# Altium project inversor_rev2.PrjPcb
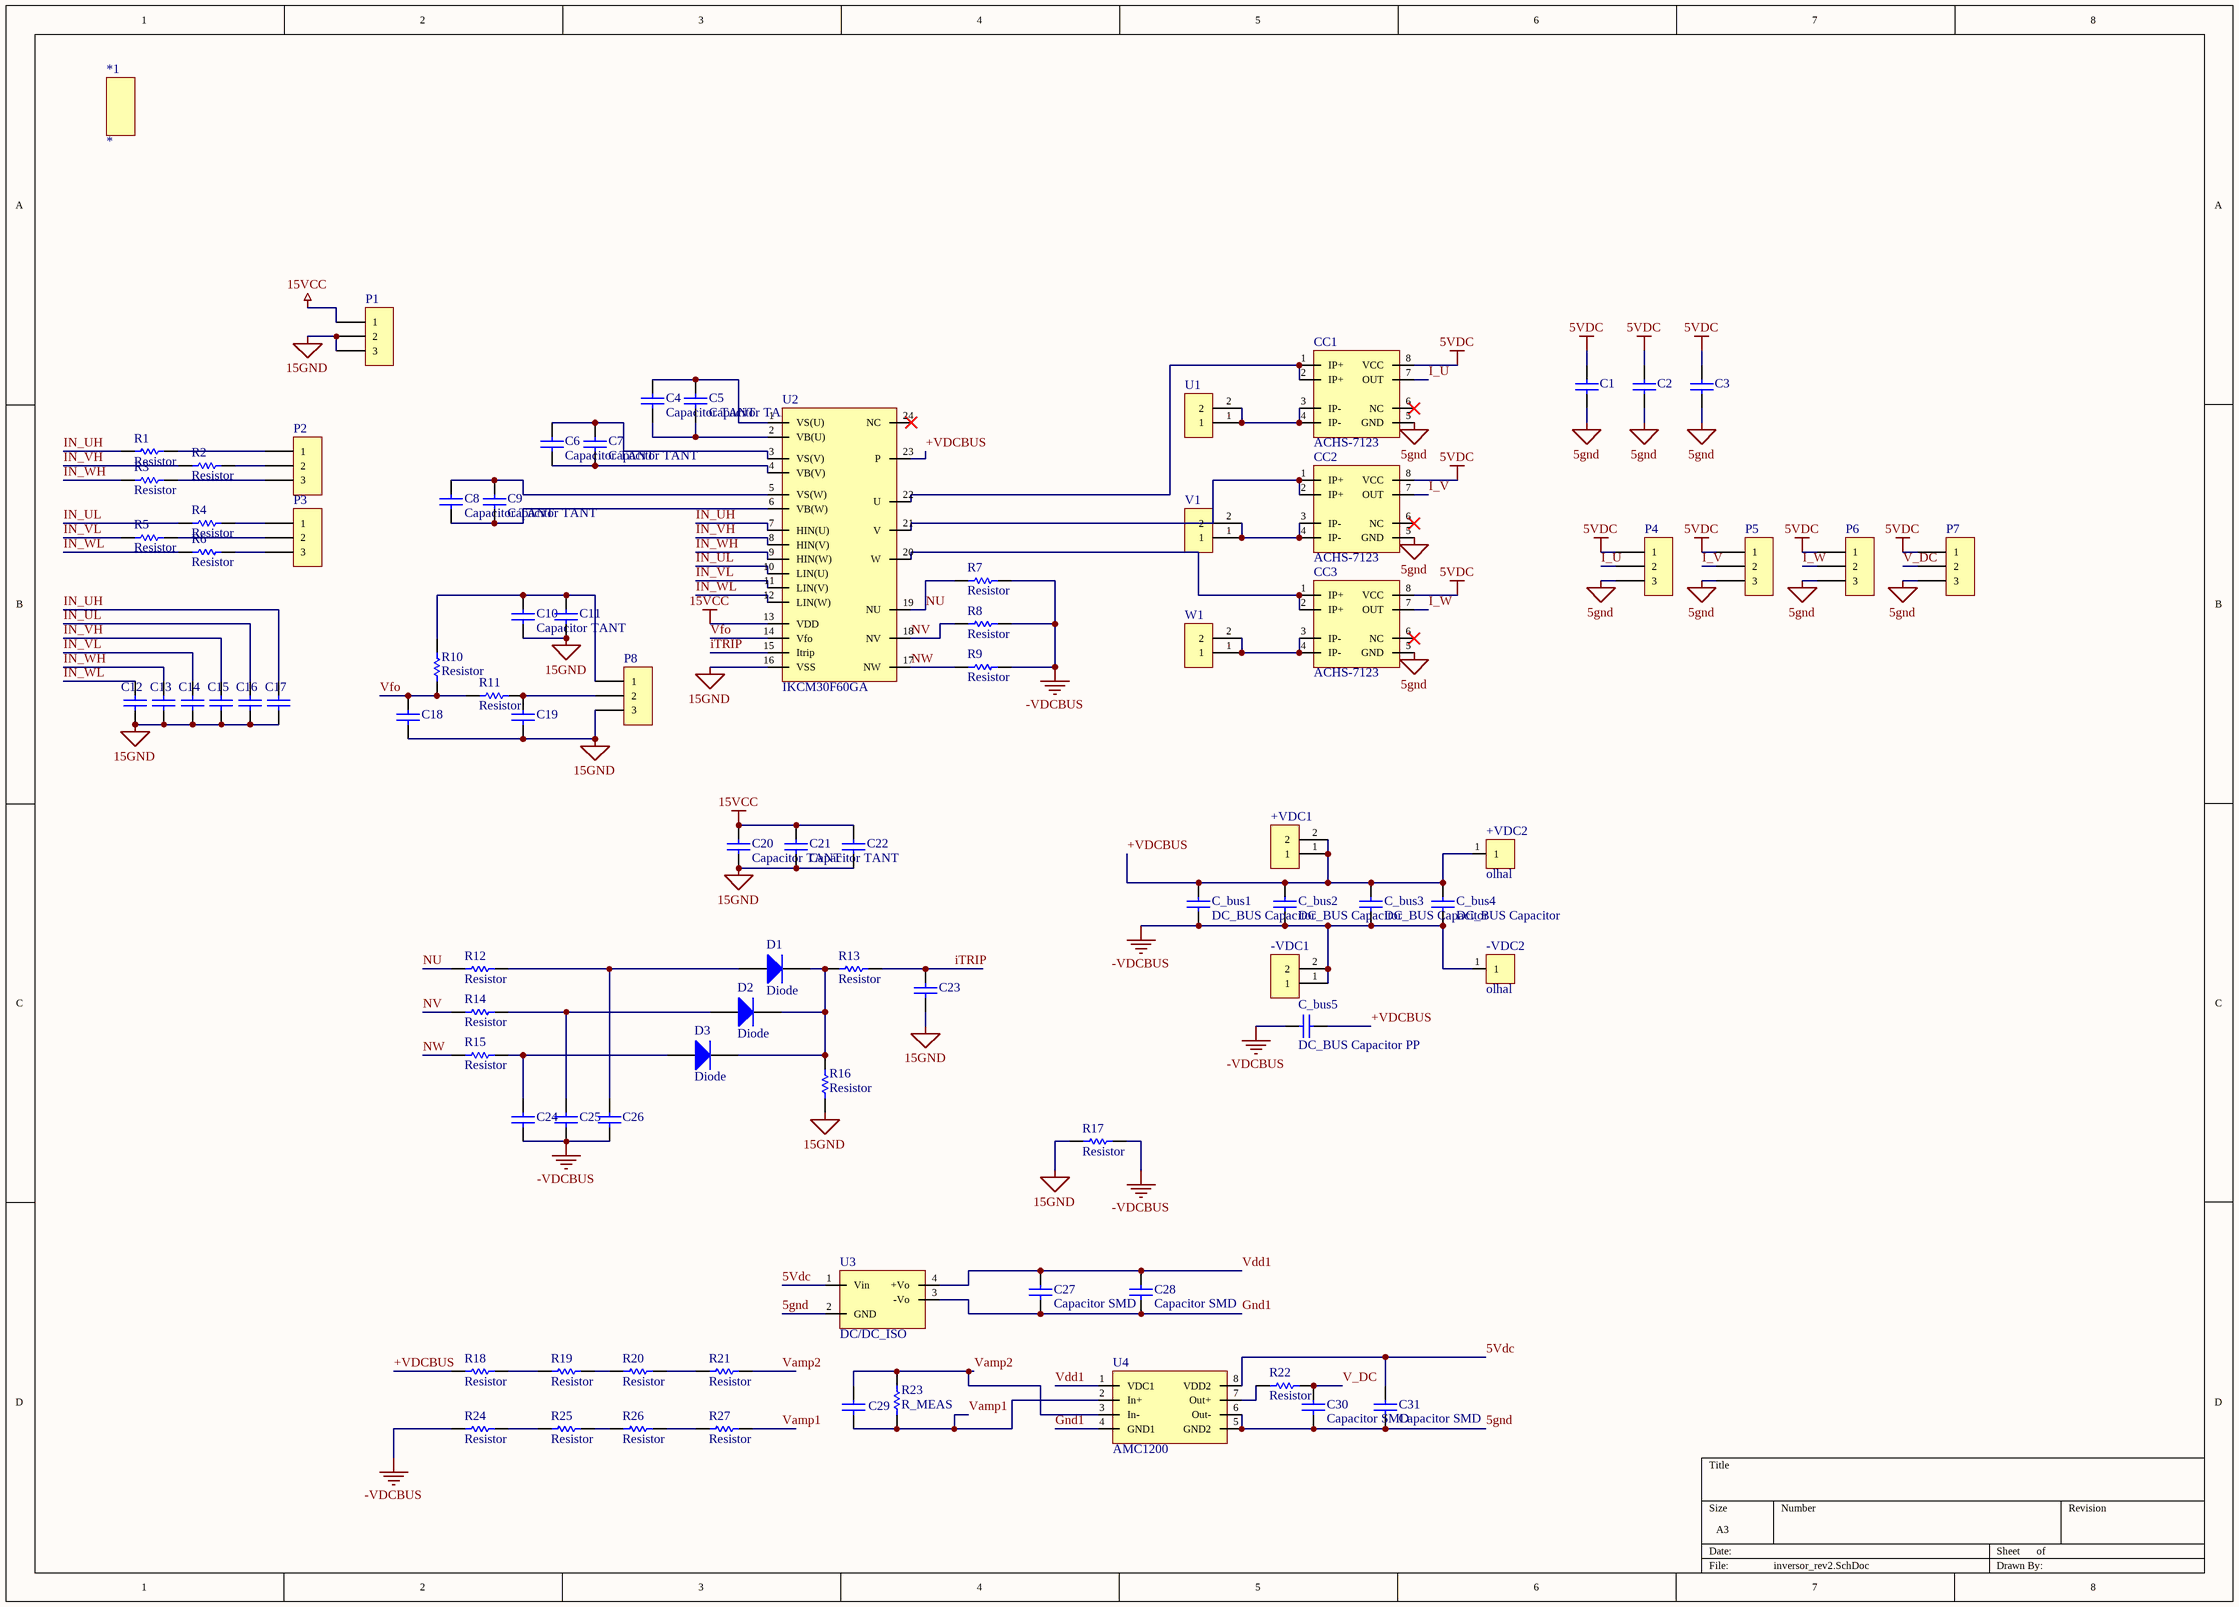
[diagram p0: inversor_rev2.SchDoc]
1 sheet, 88 parts. Net scope: global (net labels, ports and power ports of the same name join across sheets).
Board file: inversor_rev2.PcbDoc

## Sheet inversor_rev2.SchDoc
size A3

### Parts
*1  *  [COOLER]
+VDC1  gen_purpose_conn_1x2  [connector1x2_parafuso]  (value not drawn)
+VDC2  olhal  [Olhal]
-VDC1  gen_purpose_conn_1x2  [connector1x2_parafuso]  (value not drawn)
-VDC2  olhal  [Olhal]
C1  Capacitor SMD  [CAPC_1206]  (value not drawn)
C2  Capacitor SMD  [CAPC_1206]  (value not drawn)
C3  Capacitor SMD  [CAPC_1206]  (value not drawn)
C4  Capacitor TANT  [CAPC_2917]
C5  Capacitor TANT  [CAPC_2917]
C6  Capacitor TANT  [CAPC_2917]
C7  Capacitor TANT  [CAPC_2917]
C8  Capacitor TANT  [CAPC_2917]
C9  Capacitor TANT  [CAPC_2917]
C10  Capacitor TANT  [CAPC_2917]
C11  Capacitor SMD  [CAPC_1206]  (value not drawn)
C12  Capacitor SMD  [CAPC_0805]  (value not drawn)
C13  Capacitor SMD  [CAPC_0805]  (value not drawn)
C14  Capacitor SMD  [CAPC_0805]  (value not drawn)
C15  Capacitor SMD  [CAPC_0805]  (value not drawn)
C16  Capacitor SMD  [CAPC_0805]  (value not drawn)
C17  Capacitor SMD  [CAPC_0805]  (value not drawn)
C18  Capacitor SMD  [CAPC_0805]  (value not drawn)
C19  Capacitor SMD  [CAPC_0805]  (value not drawn)
C20  Capacitor TANT  [CAPC_2917]
C21  Capacitor TANT  [CAPC_2917]
C22  Capacitor SMD  [CAPC_1206]  (value not drawn)
C23  Capacitor SMD  [CAPC_0805]  (value not drawn)
C24  Capacitor SMD  [CAPC_0805]  (value not drawn)
C25  Capacitor SMD  [CAPC_0805]  (value not drawn)
C26  Capacitor SMD  [CAPC_0805]  (value not drawn)
C27  Capacitor SMD  [CAPC_0805]
C28  Capacitor SMD  [CAPC_0805]
C29  Capacitor SMD  [CAPC_0805]  (value not drawn)
C30  Capacitor SMD  [CAPC_0805]
C31  Capacitor SMD  [CAPC_0805]
C_bus1  DC_BUS Capacitor  [Capacitor_DCBUS]
C_bus2  DC_BUS Capacitor  [Capacitor_DCBUS]
C_bus3  DC_BUS Capacitor  [Capacitor_DCBUS]
C_bus4  DC_BUS Capacitor  [Capacitor_DCBUS]
C_bus5  DC_BUS Capacitor PP  [Snubber_cap_0.47uF]
CC1  ACHS-7123  [CC6303_SOP8]
CC2  ACHS-7123  [CC6303_SOP8]
CC3  ACHS-7123  [CC6303_SOP8]
D1  Diode  [Diode_th]
D2  Diode  [Diode_th]
D3  Diode  [Diode_th]
P1  Header 3  [HDR1X3]  (value not drawn)
P2  Header 3  [HDR1X3]  (value not drawn)
P3  Header 3  [HDR1X3]  (value not drawn)
P4  Header 3  [HDR1X3]  (value not drawn)
P5  Header 3  [HDR1X3]  (value not drawn)
P6  Header 3  [HDR1X3]  (value not drawn)
P7  Header 3  [HDR1X3]  (value not drawn)
P8  Header 3  [HDR1X3]  (value not drawn)
R1  Resistor  [RESC_0805]
R2  Resistor  [RESC_0805]
R3  Resistor  [RESC_0805]
R4  Resistor  [RESC_0805]
R5  Resistor  [RESC_0805]
R6  Resistor  [RESC_0805]
R7  Resistor  [RESC6432X09M]
R8  Resistor  [RESC6432X09M]
R9  Resistor  [RESC6432X09M]
R10  Resistor  [RESC_0805]
R11  Resistor  [RESC_0805]
R12  Resistor  [RESC_0805]
R13  Resistor  [RESC_0805]
R14  Resistor  [RESC_0805]
R15  Resistor  [RESC_0805]
R16  Resistor  [RESC_0805]
R17  Resistor  [RESC_0805]
R18  Resistor  [RESC_0805]
R19  Resistor  [RESC_0805]
R20  Resistor  [RESC_0805]
R21  Resistor  [RESC_0805]
R22  Resistor  [RESC_0805]
R23  R_MEAS  [RESC_0805]
R24  Resistor  [RESC_0805]
R25  Resistor  [RESC_0805]
R26  Resistor  [RESC_0805]
R27  Resistor  [RESC_0805]
U1  gen_purpose_conn_1x2  [connector1x2_parafuso]  (value not drawn)
U2  IKCM30F60GA  [ikcm30f60ga]
U3  DC/DC_ISO  [DC/DC_ISO]
U4  AMC1200  [SOIC8]
V1  gen_purpose_conn_1x2  [connector1x2_parafuso]  (value not drawn)
W1  gen_purpose_conn_1x2  [connector1x2_parafuso]  (value not drawn)

### Nets
5gnd: C1.1 C2.1 C3.1 C30.1 C31.1 CC1.5(GND) CC2.5(GND) CC3.5(GND) P4.3 P5.3 P6.3 P7.3 U3.2(GND) U4.5(GND2) U4.6(Out-)
5Vdc: C1.2 C2.2 C3.2 C31.2 CC1.8(VCC) CC2.8(VCC) CC3.8(VCC) P4.1 P5.1 P6.1 P7.1 U3.1(Vin) U4.8(VDD2)
15GND: C10.1 C11.1 C12.1 C13.1 C14.1 C15.1 C16.1 C17.1 C18.1 C19.1 C20.1 C21.1 C22.1 C23.1 P1.2 P1.3 P8.3 R16.1 R17.1 U2.16(VSS)
15VCC: C20.2 C21.2 C22.2 P1.1 U2.13(VDD)
-VDCBUS: -VDC1.1 -VDC1.2 -VDC2.1 C24.1 C25.1 C26.1 C_bus1.1 C_bus2.1 C_bus3.1 C_bus4.1 C_bus5.1 R7.2 R8.2 R9.2 R17.2 R24.1
+VDCBUS: +VDC1.1 +VDC1.2 +VDC2.1 C_bus1.2 C_bus2.2 C_bus3.2 C_bus4.2 C_bus5.2 R18.1 U2.23(P)
Gnd1: C27.1 C28.1 U3.3(-Vo) U4.4(GND1)
I_U: CC1.7(OUT) P4.2
I_V: CC2.7(OUT) P5.2
I_W: CC3.7(OUT) P6.2
IN_UH: C17.2 R1.1 U2.7(HIN(U))
IN_UL: C16.2 R4.1 U2.10(LIN(U))
IN_VH: C15.2 R2.1 U2.8(HIN(V))
IN_VL: C14.2 R5.1 U2.11(LIN(V))
IN_WH: C13.2 R3.1 U2.9(HIN(W))
IN_WL: C12.2 R6.1 U2.12(LIN(W))
iTRIP: C23.2 R13.2 U2.15(Itrip)
NU: R7.1 R12.1 U2.19(NU)
NV: R8.1 R14.1 U2.18(NV)
NW: R9.1 R15.1 U2.17(NW)
V_DC: C30.2 P7.2 R22.2
Vamp1: C29.1 R23.1 R27.2 U4.2(In+)
Vamp2: C29.2 R21.2 R23.2 U4.3(In-)
Vdd1: C27.2 C28.2 U3.4(+Vo) U4.1(VDC1)
Vfo: C18.2 R10.2 R11.1 U2.14(Vfo)
NetC4_1: C4.1 C5.1 U2.2(VB(U))
NetC4_2: C4.2 C5.2 U2.1(VS(U))
NetC6_1: C6.1 C7.1 U2.4(VB(V))
NetC6_2: C6.2 C7.2 U2.3(VS(V))
NetC8_1: C8.1 C9.1 U2.6(VB(W))
NetC8_2: C8.2 C9.2 U2.5(VS(W))
NetC10_2: C10.2 C11.2 P8.1 R10.1
NetC19_2: C19.2 P8.2 R11.2
NetC24_2: C24.2 D3.1(A) R15.2
NetC25_2: C25.2 D2.1(A) R14.2
NetC26_2: C26.2 D1.1(A) R12.2
NetCC1_1: CC1.1(IP+) CC1.2(IP+) U2.22(U)
NetCC1_3: CC1.3(IP-) CC1.4(IP-) U1.1 U1.2
NetCC2_1: CC2.1(IP+) CC2.2(IP+) U2.21(V)
NetCC2_3: CC2.3(IP-) CC2.4(IP-) V1.1 V1.2
NetCC3_1: CC3.1(IP+) CC3.2(IP+) U2.20(W)
NetCC3_3: CC3.3(IP-) CC3.4(IP-) W1.1 W1.2
NetD1_2: D1.2(K) D2.2(K) D3.2(K) R13.1 R16.2
NetP2_1: P2.1 R1.2
NetP2_2: P2.2 R2.2
NetP2_3: P2.3 R3.2
NetP3_1: P3.1 R4.2
NetP3_2: P3.2 R5.2
NetP3_3: P3.3 R6.2
NetR18_2: R18.2 R19.1
NetR19_2: R19.2 R20.1
NetR20_2: R20.2 R21.1
NetR22_1: R22.1 U4.7(Out+)
NetR24_2: R24.2 R25.1
NetR25_2: R25.2 R26.1
NetR26_2: R26.2 R27.1

Not connected (* = marked no-connect by the designer): CC1 6(NC)*; CC2 6(NC)*; CC3 6(NC)*; U2 24(NC)*

### Library data of the parts
*1 = cooler
+VDC1 -VDC1 U1 V1 W1 = gen_purpose_conn_1x2: VPN: 172-2555; LCSC: C138464
C1-C3 C11 C22 C27 C28 C31 = Capacitor SMD: 10uF
C4-C9 = tantalum_CAP: 10uF 50V TANT
C10 C20 C21 = tantalum_CAP: 10uF 50V TANT; VPN: 75-MKP1848610704K2; LCSC: C224948
C12-C19 C23-C26 = Capacitor SMD: 10nF
C29 C30 = Capacitor SMD: 1uF
C_bus1-C_bus4 = CAPACITOR_dcbus: DC_BUS CAP; VPN: 505-DCP5-114/900/10
C_bus5 = CAPACITOR_dcbus: DC_BUS  CAP PP; VPN: 505-DCP5-114/900/10
CC1-CC3 = Current_Sensor_cc6303: VPN: 630-ACHS-7123-000E; LCSC: C286005
D1-D3 = Diode: 1N4148; Published: 8-Jun-2000; LatestRevisionDate: 17-Jul-2002; LatestRevisionNote: Re-released for DXP Platform.; PackageVersion: Sep-1996; PackageReference: SMC; Publisher: Altium Limited; PackageDescription: DO-214-AB/SMC; 2 C-Bend Leads; Body 7.9 x 5.9 mm, inc. leads (LxW); Code_JEDEC: DO-214-AB
P1-P8 = Header 3: Header, 3 pin
R1-R6 R12 R14 R15 = Resistor: 100R
R7-R9 = Resistor: Current sense resistor
R10 = Resistor: 3K6
R11 = Resistor: 1K
R13 = Resistor: 1K8
R16 = Resistor: 3K
R17 = Resistor: 0R
R18-R21 R24-R27 = Resistor: 30K; LCSC: C40087
R22 = Resistor: 330R; LCSC: C269732
R23 = Resistor: 150R
U2 = IKCM30F60GA: Intelligent Power Module 600V@30A
U3 = DC/DC_ISO: LCSC: C98815
U4 = AMC1200: LCSC: C79905